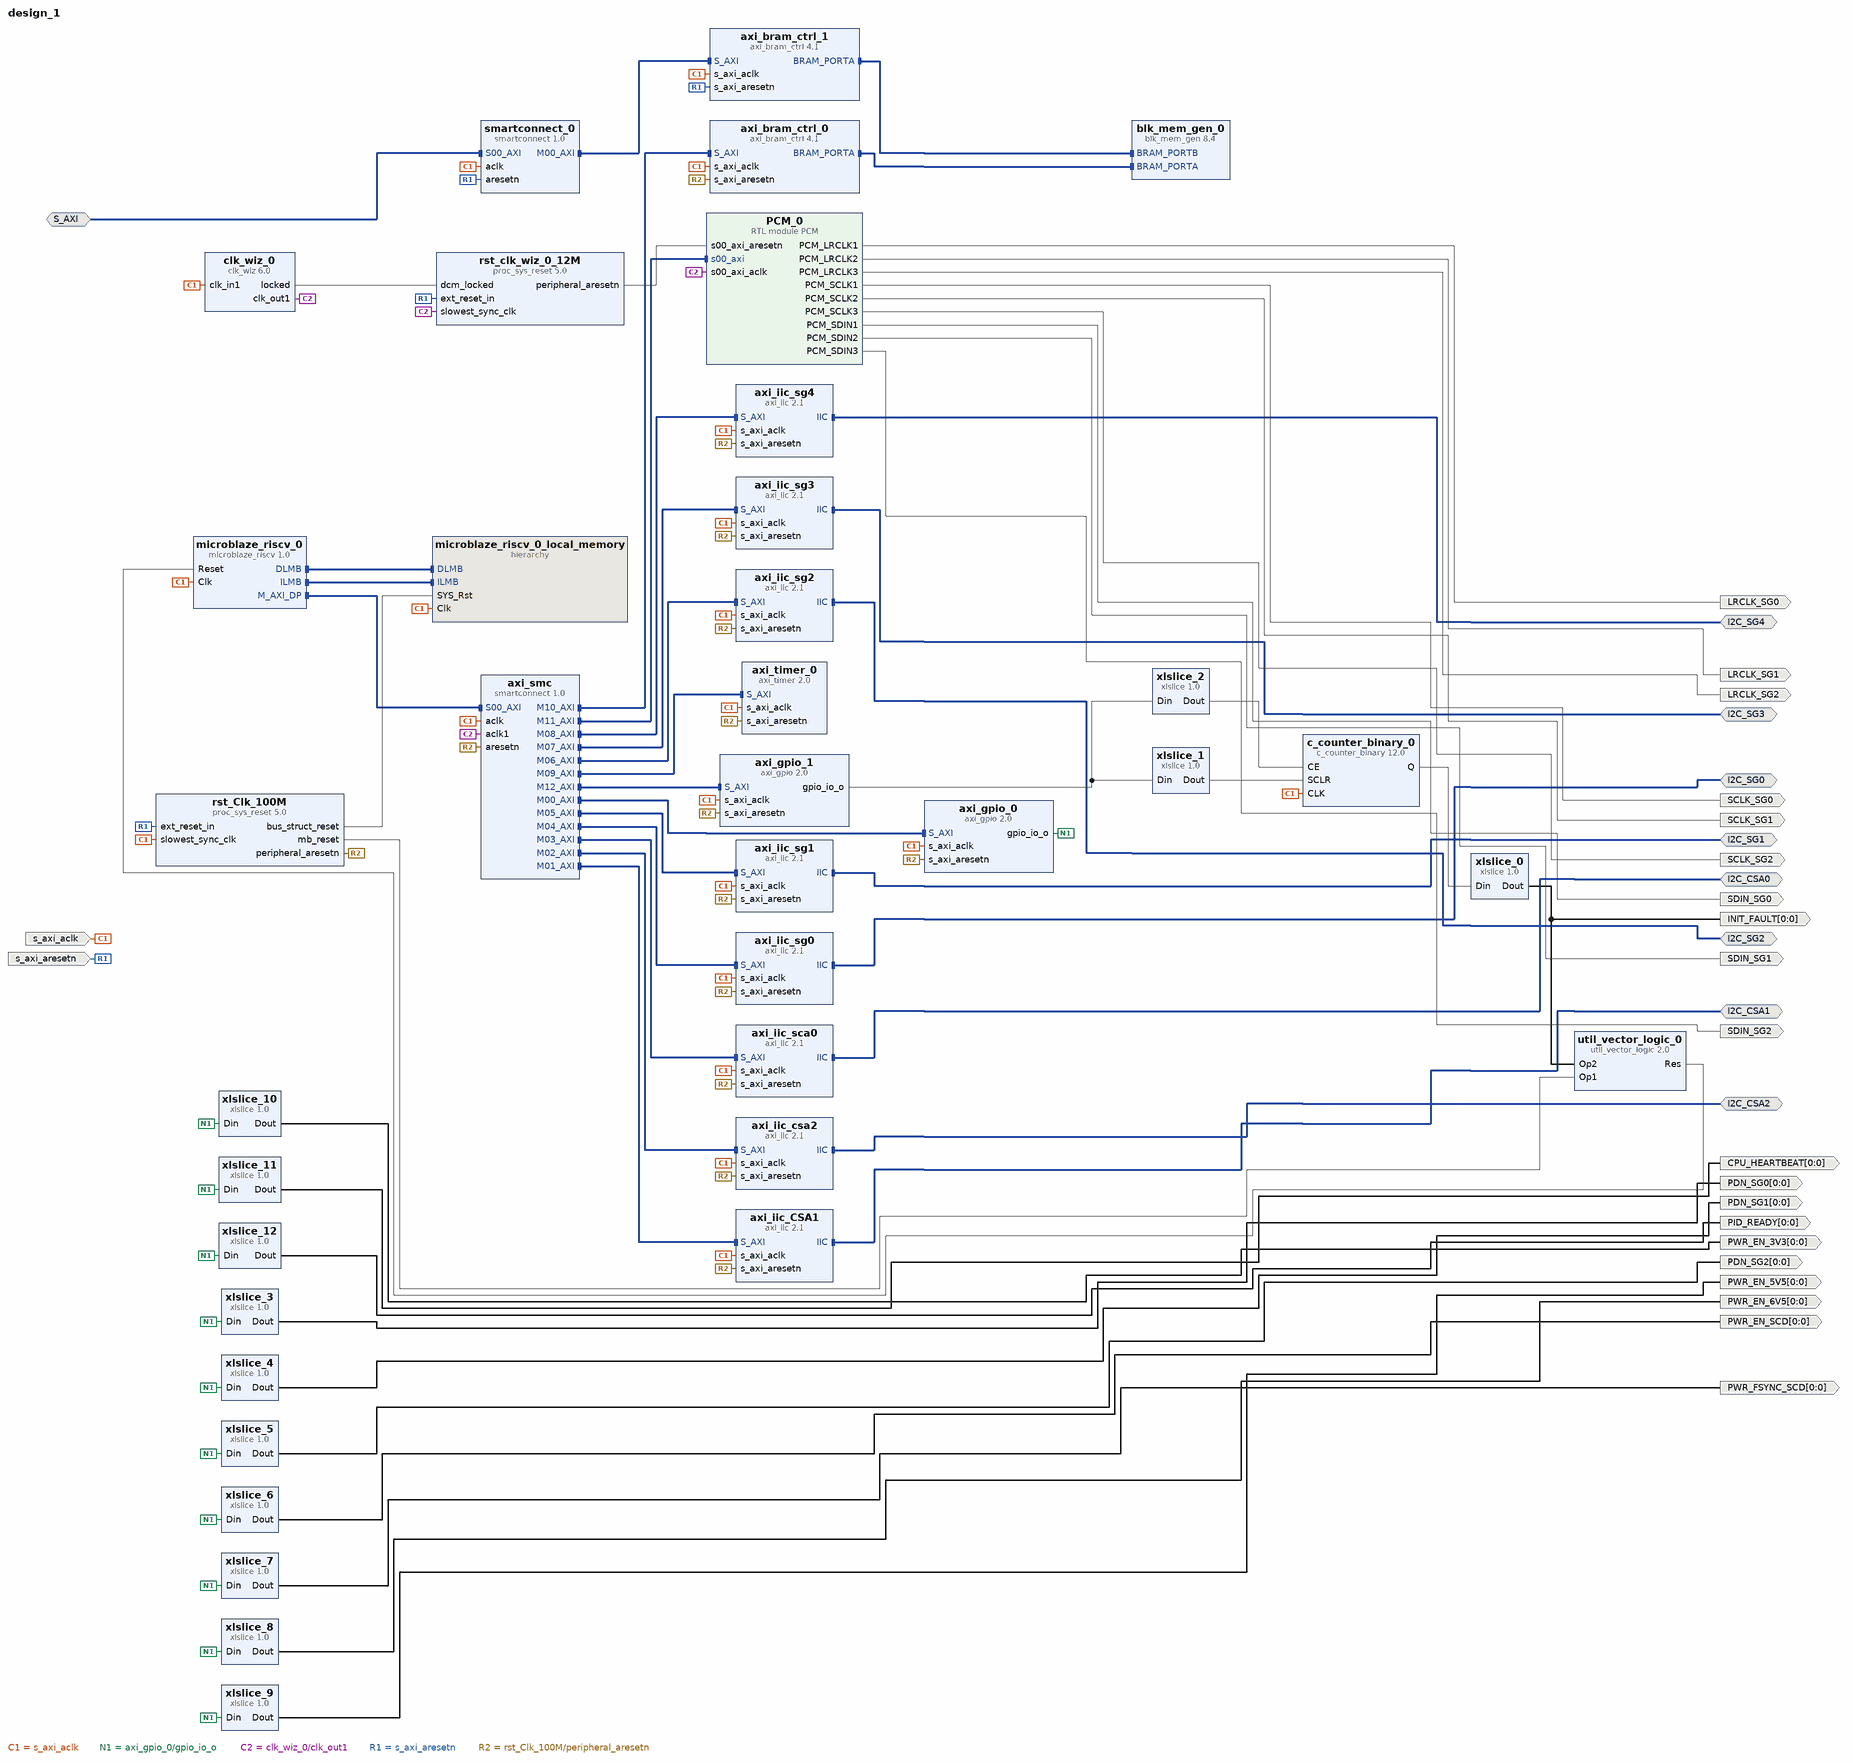
[diagram p0: block diagram of the top level]
# Vivado block design design_1, xc7s100fgga484-1, Vivado 2024.2
create_bd_design design_1

create_bd_intf_port -mode Master -vlnv xilinx.com:interface:iic_rtl:1.0 I2C_SG0
create_bd_intf_port -mode Master -vlnv xilinx.com:interface:iic_rtl:1.0 I2C_SG1
create_bd_intf_port -mode Master -vlnv xilinx.com:interface:iic_rtl:1.0 I2C_SG2
create_bd_intf_port -mode Master -vlnv xilinx.com:interface:iic_rtl:1.0 I2C_SG3
create_bd_intf_port -mode Master -vlnv xilinx.com:interface:iic_rtl:1.0 I2C_SG4
create_bd_intf_port -mode Master -vlnv xilinx.com:interface:iic_rtl:1.0 I2C_CSA0
create_bd_intf_port -mode Master -vlnv xilinx.com:interface:iic_rtl:1.0 I2C_CSA1
create_bd_intf_port -mode Master -vlnv xilinx.com:interface:iic_rtl:1.0 I2C_CSA2
create_bd_intf_port -mode Slave -vlnv xilinx.com:interface:aximm_rtl:1.0 S_AXI
set_property -dict [list \
  CONFIG.ADDR_WIDTH 32 \
  CONFIG.ARUSER_WIDTH 0 \
  CONFIG.AWUSER_WIDTH 0 \
  CONFIG.BUSER_WIDTH 0 \
  CONFIG.DATA_WIDTH 32 \
  CONFIG.HAS_BRESP 1 \
  CONFIG.HAS_BURST 1 \
  CONFIG.HAS_CACHE 1 \
  CONFIG.HAS_LOCK 1 \
  CONFIG.HAS_PROT 1 \
  CONFIG.HAS_QOS 1 \
  CONFIG.HAS_REGION 1 \
  CONFIG.HAS_RRESP 1 \
  CONFIG.HAS_WSTRB 1 \
  CONFIG.ID_WIDTH 0 \
  CONFIG.MAX_BURST_LENGTH 256 \
  CONFIG.NUM_READ_OUTSTANDING 1 \
  CONFIG.NUM_READ_THREADS 1 \
  CONFIG.NUM_WRITE_OUTSTANDING 1 \
  CONFIG.NUM_WRITE_THREADS 1 \
  CONFIG.PROTOCOL AXI4 \
  CONFIG.READ_WRITE_MODE READ_WRITE \
  CONFIG.RUSER_BITS_PER_BYTE 0 \
  CONFIG.RUSER_WIDTH 0 \
  CONFIG.SUPPORTS_NARROW_BURST 1 \
  CONFIG.WUSER_BITS_PER_BYTE 0 \
  CONFIG.WUSER_WIDTH 0 \
] [get_bd_intf_ports S_AXI]
create_bd_port -dir I -type rst s_axi_aresetn
set_property -dict {CONFIG.POLARITY ACTIVE_LOW} [get_bd_ports s_axi_aresetn]
create_bd_port -dir O LRCLK_SG0
create_bd_port -dir O SCLK_SG0
create_bd_port -dir O SDIN_SG0
create_bd_port -dir O LRCLK_SG1
create_bd_port -dir O SCLK_SG1
create_bd_port -dir O SDIN_SG1
create_bd_port -dir O LRCLK_SG2
create_bd_port -dir O SCLK_SG2
create_bd_port -dir O SDIN_SG2
create_bd_port -dir O -from 0 -to 0 INIT_FAULT
create_bd_port -dir I -type clk s_axi_aclk
set_property -dict {CONFIG.ASSOCIATED_BUSIF S_AXI} [get_bd_ports s_axi_aclk]
create_bd_port -dir O -from 0 -to 0 PDN_SG0
create_bd_port -dir O -from 0 -to 0 PDN_SG1
create_bd_port -dir O -from 0 -to 0 PDN_SG2
create_bd_port -dir O -from 0 -to 0 PWR_EN_SCD
create_bd_port -dir O -from 0 -to 0 PWR_FSYNC_SCD
create_bd_port -dir O -from 0 -to 0 PWR_EN_6V5
create_bd_port -dir O -from 0 -to 0 PWR_EN_5V5
create_bd_port -dir O -from 0 -to 0 PWR_EN_3V3
create_bd_port -dir O -from 0 -to 0 CPU_HEARTBEAT
create_bd_port -dir O -from 0 -to 0 PID_READY

create_bd_cell -type ip -vlnv xilinx.com:ip:microblaze_riscv:1.0 microblaze_riscv_0
set_property -dict {CONFIG.C_DEBUG_ENABLED 1 CONFIG.C_D_AXI 1 CONFIG.C_D_LMB 1 CONFIG.C_I_LMB 1} [get_bd_cells microblaze_riscv_0]
create_bd_cell -type hier microblaze_riscv_0_local_memory
create_bd_cell -type ip -vlnv xilinx.com:ip:proc_sys_reset:5.0 rst_Clk_100M
create_bd_cell -type ip -vlnv xilinx.com:ip:clk_wiz:6.0 clk_wiz_0
set_property -dict [list \
  CONFIG.CLKOUT1_JITTER 360.948 \
  CONFIG.CLKOUT1_PHASE_ERROR 301.601 \
  CONFIG.CLKOUT1_REQUESTED_OUT_FREQ 12.288 \
  CONFIG.MMCM_CLKFBOUT_MULT_F 48.000 \
  CONFIG.MMCM_CLKOUT0_DIVIDE_F 78.125 \
  CONFIG.MMCM_DIVCLK_DIVIDE 5 \
  CONFIG.USE_LOCKED true \
  CONFIG.USE_RESET false \
] [get_bd_cells clk_wiz_0]
create_bd_cell -type ip -vlnv xilinx.com:ip:proc_sys_reset:5.0 rst_clk_wiz_0_12M
create_bd_cell -type ip -vlnv xilinx.com:ip:axi_timer:2.0 axi_timer_0
set_property -dict {CONFIG.enable_timer2 0} [get_bd_cells axi_timer_0]
create_bd_cell -type ip -vlnv xilinx.com:ip:axi_iic:2.1 axi_iic_sg0
set_property -dict {CONFIG.IIC_FREQ_KHZ 100} [get_bd_cells axi_iic_sg0]
create_bd_cell -type ip -vlnv xilinx.com:ip:axi_iic:2.1 axi_iic_sg1
set_property -dict {CONFIG.IIC_FREQ_KHZ 100} [get_bd_cells axi_iic_sg1]
create_bd_cell -type ip -vlnv xilinx.com:ip:axi_iic:2.1 axi_iic_sg2
set_property -dict {CONFIG.IIC_FREQ_KHZ 100} [get_bd_cells axi_iic_sg2]
create_bd_cell -type ip -vlnv xilinx.com:ip:axi_iic:2.1 axi_iic_sg3
set_property -dict {CONFIG.C_DEFAULT_VALUE 0x00 CONFIG.IIC_FREQ_KHZ 100} [get_bd_cells axi_iic_sg3]
create_bd_cell -type ip -vlnv xilinx.com:ip:axi_iic:2.1 axi_iic_sg4
set_property -dict {CONFIG.IIC_FREQ_KHZ 100} [get_bd_cells axi_iic_sg4]
create_bd_cell -type ip -vlnv xilinx.com:ip:axi_iic:2.1 axi_iic_sca0
set_property -dict {CONFIG.IIC_FREQ_KHZ 1000} [get_bd_cells axi_iic_sca0]
create_bd_cell -type ip -vlnv xilinx.com:ip:axi_iic:2.1 axi_iic_CSA1
set_property -dict {CONFIG.IIC_FREQ_KHZ 1000} [get_bd_cells axi_iic_CSA1]
create_bd_cell -type ip -vlnv xilinx.com:ip:axi_iic:2.1 axi_iic_csa2
set_property -dict {CONFIG.IIC_FREQ_KHZ 1000} [get_bd_cells axi_iic_csa2]
create_bd_cell -type ip -vlnv xilinx.com:ip:c_counter_binary:12.0 c_counter_binary_0
set_property -dict {CONFIG.CE true CONFIG.Output_Width 24 CONFIG.SCLR true} [get_bd_cells c_counter_binary_0]
create_bd_cell -type ip -vlnv xilinx.com:ip:axi_gpio:2.0 axi_gpio_0
set_property -dict {CONFIG.C_ALL_OUTPUTS 1 CONFIG.C_GPIO_WIDTH 10} [get_bd_cells axi_gpio_0]
create_bd_cell -type module -reference PCM PCM_0
create_bd_cell -type ip -vlnv xilinx.com:ip:smartconnect:1.0 axi_smc
set_property -dict {CONFIG.NUM_CLKS 2 CONFIG.NUM_MI 13 CONFIG.NUM_SI 1} [get_bd_cells axi_smc]
create_bd_cell -type ip -vlnv xilinx.com:ip:axi_gpio:2.0 axi_gpio_1
set_property -dict {CONFIG.C_ALL_OUTPUTS 1 CONFIG.C_GPIO_WIDTH 2} [get_bd_cells axi_gpio_1]
create_bd_cell -type ip -vlnv xilinx.com:ip:xlslice:1.0 xlslice_1
set_property -dict {CONFIG.DIN_WIDTH 2} [get_bd_cells xlslice_1]
create_bd_cell -type ip -vlnv xilinx.com:ip:xlslice:1.0 xlslice_2
set_property -dict {CONFIG.DIN_FROM 1 CONFIG.DIN_TO 1 CONFIG.DIN_WIDTH 2} [get_bd_cells xlslice_2]
create_bd_cell -type ip -vlnv xilinx.com:ip:xlslice:1.0 xlslice_0
set_property -dict {CONFIG.DIN_FROM 23 CONFIG.DIN_TO 23 CONFIG.DIN_WIDTH 24} [get_bd_cells xlslice_0]
create_bd_cell -type ip -vlnv xilinx.com:ip:util_vector_logic:2.0 util_vector_logic_0
set_property -dict {CONFIG.C_OPERATION or CONFIG.C_SIZE 1} [get_bd_cells util_vector_logic_0]
create_bd_cell -type ip -vlnv xilinx.com:ip:xlslice:1.0 xlslice_3
set_property -dict {CONFIG.DIN_WIDTH 10} [get_bd_cells xlslice_3]
create_bd_cell -type ip -vlnv xilinx.com:ip:xlslice:1.0 xlslice_4
set_property -dict {CONFIG.DIN_FROM 1 CONFIG.DIN_TO 1 CONFIG.DIN_WIDTH 10} [get_bd_cells xlslice_4]
create_bd_cell -type ip -vlnv xilinx.com:ip:xlslice:1.0 xlslice_5
set_property -dict {CONFIG.DIN_FROM 2 CONFIG.DIN_TO 2 CONFIG.DIN_WIDTH 10} [get_bd_cells xlslice_5]
create_bd_cell -type ip -vlnv xilinx.com:ip:xlslice:1.0 xlslice_6
set_property -dict {CONFIG.DIN_FROM 3 CONFIG.DIN_TO 3 CONFIG.DIN_WIDTH 10} [get_bd_cells xlslice_6]
create_bd_cell -type ip -vlnv xilinx.com:ip:xlslice:1.0 xlslice_7
set_property -dict {CONFIG.DIN_FROM 4 CONFIG.DIN_TO 4 CONFIG.DIN_WIDTH 10} [get_bd_cells xlslice_7]
create_bd_cell -type ip -vlnv xilinx.com:ip:xlslice:1.0 xlslice_8
set_property -dict {CONFIG.DIN_FROM 5 CONFIG.DIN_TO 5 CONFIG.DIN_WIDTH 10} [get_bd_cells xlslice_8]
create_bd_cell -type ip -vlnv xilinx.com:ip:xlslice:1.0 xlslice_9
set_property -dict {CONFIG.DIN_FROM 6 CONFIG.DIN_TO 6 CONFIG.DIN_WIDTH 10} [get_bd_cells xlslice_9]
create_bd_cell -type ip -vlnv xilinx.com:ip:xlslice:1.0 xlslice_10
set_property -dict {CONFIG.DIN_FROM 7 CONFIG.DIN_TO 7 CONFIG.DIN_WIDTH 10} [get_bd_cells xlslice_10]
create_bd_cell -type ip -vlnv xilinx.com:ip:xlslice:1.0 xlslice_11
set_property -dict {CONFIG.DIN_FROM 8 CONFIG.DIN_TO 8 CONFIG.DIN_WIDTH 10} [get_bd_cells xlslice_11]
create_bd_cell -type ip -vlnv xilinx.com:ip:xlslice:1.0 xlslice_12
set_property -dict {CONFIG.DIN_FROM 9 CONFIG.DIN_TO 9 CONFIG.DIN_WIDTH 10} [get_bd_cells xlslice_12]
create_bd_cell -type ip -vlnv xilinx.com:ip:axi_bram_ctrl:4.1 axi_bram_ctrl_0
set_property -dict {CONFIG.SINGLE_PORT_BRAM 1} [get_bd_cells axi_bram_ctrl_0]
create_bd_cell -type ip -vlnv xilinx.com:ip:blk_mem_gen:8.4 blk_mem_gen_0
set_property -dict {CONFIG.Memory_Type True_Dual_Port_RAM} [get_bd_cells blk_mem_gen_0]
create_bd_cell -type ip -vlnv xilinx.com:ip:axi_bram_ctrl:4.1 axi_bram_ctrl_1
set_property -dict {CONFIG.SINGLE_PORT_BRAM 1} [get_bd_cells axi_bram_ctrl_1]
create_bd_cell -type ip -vlnv xilinx.com:ip:smartconnect:1.0 smartconnect_0
set_property -dict {CONFIG.NUM_SI 1} [get_bd_cells smartconnect_0]

# ---- hierarchy /microblaze_riscv_0_local_memory ----
current_bd_instance /microblaze_riscv_0_local_memory
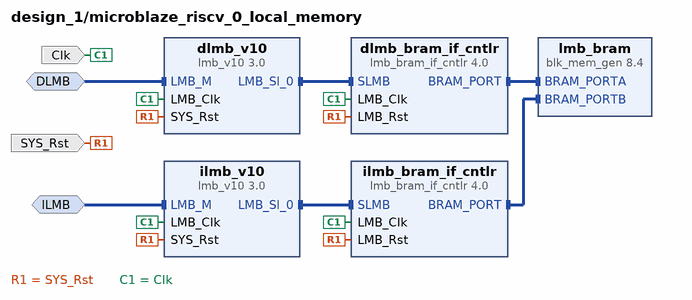
[diagram p1: block diagram inside /microblaze_riscv_0_local_memory]
create_bd_intf_pin -mode MirroredMaster -vlnv xilinx.com:interface:lmb_rtl:1.0 DLMB
create_bd_intf_pin -mode MirroredMaster -vlnv xilinx.com:interface:lmb_rtl:1.0 ILMB
create_bd_pin -dir I -type clk Clk
create_bd_pin -dir I -type rst SYS_Rst

create_bd_cell -type ip -vlnv xilinx.com:ip:lmb_v10:3.0 dlmb_v10
create_bd_cell -type ip -vlnv xilinx.com:ip:lmb_v10:3.0 ilmb_v10
create_bd_cell -type ip -vlnv xilinx.com:ip:lmb_bram_if_cntlr:4.0 dlmb_bram_if_cntlr
set_property -dict {CONFIG.C_ECC 0} [get_bd_cells dlmb_bram_if_cntlr]
create_bd_cell -type ip -vlnv xilinx.com:ip:lmb_bram_if_cntlr:4.0 ilmb_bram_if_cntlr
set_property -dict {CONFIG.C_ECC 0} [get_bd_cells ilmb_bram_if_cntlr]
create_bd_cell -type ip -vlnv xilinx.com:ip:blk_mem_gen:8.4 lmb_bram
set_property -dict {CONFIG.Memory_Type True_Dual_Port_RAM CONFIG.use_bram_block BRAM_Controller} [get_bd_cells lmb_bram]

# ---- connections ----

current_bd_instance /microblaze_riscv_0_local_memory
connect_bd_intf_net -intf_net microblaze_riscv_0_dlmb [get_bd_intf_pins dlmb_v10/LMB_M] [get_bd_intf_pins DLMB]
connect_bd_intf_net -intf_net microblaze_riscv_0_dlmb_bus [get_bd_intf_pins dlmb_v10/LMB_Sl_0] [get_bd_intf_pins dlmb_bram_if_cntlr/SLMB]
connect_bd_intf_net -intf_net microblaze_riscv_0_dlmb_cntlr [get_bd_intf_pins dlmb_bram_if_cntlr/BRAM_PORT] [get_bd_intf_pins lmb_bram/BRAM_PORTA]
connect_bd_intf_net -intf_net microblaze_riscv_0_ilmb [get_bd_intf_pins ilmb_v10/LMB_M] [get_bd_intf_pins ILMB]
connect_bd_intf_net -intf_net microblaze_riscv_0_ilmb_bus [get_bd_intf_pins ilmb_v10/LMB_Sl_0] [get_bd_intf_pins ilmb_bram_if_cntlr/SLMB]
connect_bd_intf_net -intf_net microblaze_riscv_0_ilmb_cntlr [get_bd_intf_pins ilmb_bram_if_cntlr/BRAM_PORT] [get_bd_intf_pins lmb_bram/BRAM_PORTB]
connect_bd_net [get_bd_pins SYS_Rst] \
  [get_bd_pins dlmb_v10/SYS_Rst] [get_bd_pins dlmb_bram_if_cntlr/LMB_Rst] [get_bd_pins ilmb_v10/SYS_Rst] \
  [get_bd_pins ilmb_bram_if_cntlr/LMB_Rst]
connect_bd_net -net microblaze_riscv_0_Clk [get_bd_pins Clk] \
  [get_bd_pins dlmb_v10/LMB_Clk] [get_bd_pins dlmb_bram_if_cntlr/LMB_Clk] [get_bd_pins ilmb_v10/LMB_Clk] \
  [get_bd_pins ilmb_bram_if_cntlr/LMB_Clk]
set_property HDL_ATTRIBUTE.BMM_INFO_ADDRESS_SPACE {byte  0x00000000 32 > design_1 microblaze_riscv_0_local_memory/lmb_bram} [get_bd_cells dlmb_bram_if_cntlr]
set_property HDL_ATTRIBUTE.KEEP_HIERARCHY yes [get_bd_cells dlmb_bram_if_cntlr]

current_bd_instance /
connect_bd_intf_net -intf_net S00_AXI_0_1 [get_bd_intf_ports S_AXI] [get_bd_intf_pins smartconnect_0/S00_AXI]
connect_bd_intf_net [get_bd_intf_pins blk_mem_gen_0/BRAM_PORTA] [get_bd_intf_pins axi_bram_ctrl_0/BRAM_PORTA]
connect_bd_intf_net [get_bd_intf_pins axi_bram_ctrl_1/BRAM_PORTA] [get_bd_intf_pins blk_mem_gen_0/BRAM_PORTB]
connect_bd_intf_net -intf_net axi_iic_0_IIC [get_bd_intf_ports I2C_SG0] [get_bd_intf_pins axi_iic_sg0/IIC]
connect_bd_intf_net -intf_net axi_iic_1_IIC [get_bd_intf_ports I2C_SG1] [get_bd_intf_pins axi_iic_sg1/IIC]
connect_bd_intf_net -intf_net axi_iic_2_IIC [get_bd_intf_ports I2C_SG2] [get_bd_intf_pins axi_iic_sg2/IIC]
connect_bd_intf_net -intf_net axi_iic_3_IIC [get_bd_intf_ports I2C_SG3] [get_bd_intf_pins axi_iic_sg3/IIC]
connect_bd_intf_net -intf_net axi_iic_4_IIC [get_bd_intf_ports I2C_SG4] [get_bd_intf_pins axi_iic_sg4/IIC]
connect_bd_intf_net -intf_net axi_iic_5_IIC [get_bd_intf_ports I2C_CSA0] [get_bd_intf_pins axi_iic_sca0/IIC]
connect_bd_intf_net -intf_net axi_iic_6_IIC [get_bd_intf_ports I2C_CSA1] [get_bd_intf_pins axi_iic_CSA1/IIC]
connect_bd_intf_net -intf_net axi_iic_7_IIC [get_bd_intf_ports I2C_CSA2] [get_bd_intf_pins axi_iic_csa2/IIC]
connect_bd_intf_net [get_bd_intf_pins axi_smc/M00_AXI] [get_bd_intf_pins axi_gpio_0/S_AXI]
connect_bd_intf_net [get_bd_intf_pins axi_smc/M01_AXI] [get_bd_intf_pins axi_iic_CSA1/S_AXI]
connect_bd_intf_net [get_bd_intf_pins axi_smc/M02_AXI] [get_bd_intf_pins axi_iic_csa2/S_AXI]
connect_bd_intf_net [get_bd_intf_pins axi_smc/M03_AXI] [get_bd_intf_pins axi_iic_sca0/S_AXI]
connect_bd_intf_net [get_bd_intf_pins axi_smc/M04_AXI] [get_bd_intf_pins axi_iic_sg0/S_AXI]
connect_bd_intf_net [get_bd_intf_pins axi_smc/M05_AXI] [get_bd_intf_pins axi_iic_sg1/S_AXI]
connect_bd_intf_net [get_bd_intf_pins axi_smc/M06_AXI] [get_bd_intf_pins axi_iic_sg2/S_AXI]
connect_bd_intf_net [get_bd_intf_pins axi_smc/M07_AXI] [get_bd_intf_pins axi_iic_sg3/S_AXI]
connect_bd_intf_net [get_bd_intf_pins axi_smc/M08_AXI] [get_bd_intf_pins axi_iic_sg4/S_AXI]
connect_bd_intf_net [get_bd_intf_pins axi_smc/M09_AXI] [get_bd_intf_pins axi_timer_0/S_AXI]
connect_bd_intf_net [get_bd_intf_pins axi_bram_ctrl_0/S_AXI] [get_bd_intf_pins axi_smc/M10_AXI]
connect_bd_intf_net [get_bd_intf_pins axi_smc/M11_AXI] [get_bd_intf_pins PCM_0/s00_axi]
connect_bd_intf_net [get_bd_intf_pins axi_smc/M12_AXI] [get_bd_intf_pins axi_gpio_1/S_AXI]
connect_bd_intf_net [get_bd_intf_pins microblaze_riscv_0/M_AXI_DP] [get_bd_intf_pins axi_smc/S00_AXI]
connect_bd_intf_net [get_bd_intf_pins microblaze_riscv_0/DLMB] [get_bd_intf_pins microblaze_riscv_0_local_memory/DLMB]
connect_bd_intf_net [get_bd_intf_pins microblaze_riscv_0/ILMB] [get_bd_intf_pins microblaze_riscv_0_local_memory/ILMB]
connect_bd_intf_net [get_bd_intf_pins smartconnect_0/M00_AXI] [get_bd_intf_pins axi_bram_ctrl_1/S_AXI]
connect_bd_net -net Clk_0_1 [get_bd_ports s_axi_aclk] \
  [get_bd_pins microblaze_riscv_0/Clk] [get_bd_pins microblaze_riscv_0_local_memory/Clk] \
  [get_bd_pins rst_Clk_100M/slowest_sync_clk] [get_bd_pins clk_wiz_0/clk_in1] [get_bd_pins axi_timer_0/s_axi_aclk] \
  [get_bd_pins axi_iic_sg0/s_axi_aclk] [get_bd_pins axi_iic_sg1/s_axi_aclk] [get_bd_pins axi_iic_sg2/s_axi_aclk] \
  [get_bd_pins axi_iic_sg3/s_axi_aclk] [get_bd_pins axi_iic_sg4/s_axi_aclk] [get_bd_pins axi_iic_sca0/s_axi_aclk] \
  [get_bd_pins axi_iic_CSA1/s_axi_aclk] [get_bd_pins axi_iic_csa2/s_axi_aclk] [get_bd_pins c_counter_binary_0/CLK] \
  [get_bd_pins axi_gpio_0/s_axi_aclk] [get_bd_pins axi_smc/aclk] [get_bd_pins axi_gpio_1/s_axi_aclk] \
  [get_bd_pins axi_bram_ctrl_0/s_axi_aclk] [get_bd_pins axi_bram_ctrl_1/s_axi_aclk] [get_bd_pins smartconnect_0/aclk]
connect_bd_net [get_bd_pins PCM_0/PCM_LRCLK1] [get_bd_ports LRCLK_SG0]
connect_bd_net [get_bd_pins PCM_0/PCM_LRCLK2] [get_bd_ports LRCLK_SG1]
connect_bd_net [get_bd_pins PCM_0/PCM_LRCLK3] [get_bd_ports LRCLK_SG2]
connect_bd_net [get_bd_pins PCM_0/PCM_SCLK1] [get_bd_ports SCLK_SG0]
connect_bd_net [get_bd_pins PCM_0/PCM_SCLK2] [get_bd_ports SCLK_SG1]
connect_bd_net [get_bd_pins PCM_0/PCM_SCLK3] [get_bd_ports SCLK_SG2]
connect_bd_net [get_bd_pins PCM_0/PCM_SDIN1] [get_bd_ports SDIN_SG0]
connect_bd_net [get_bd_pins PCM_0/PCM_SDIN2] [get_bd_ports SDIN_SG1]
connect_bd_net [get_bd_pins PCM_0/PCM_SDIN3] [get_bd_ports SDIN_SG2]
connect_bd_net [get_bd_pins axi_gpio_0/gpio_io_o] \
  [get_bd_pins xlslice_3/Din] [get_bd_pins xlslice_4/Din] [get_bd_pins xlslice_5/Din] [get_bd_pins xlslice_6/Din] \
  [get_bd_pins xlslice_7/Din] [get_bd_pins xlslice_8/Din] [get_bd_pins xlslice_9/Din] [get_bd_pins xlslice_10/Din] \
  [get_bd_pins xlslice_11/Din] [get_bd_pins xlslice_12/Din]
connect_bd_net [get_bd_pins axi_gpio_1/gpio_io_o] [get_bd_pins xlslice_1/Din] [get_bd_pins xlslice_2/Din]
connect_bd_net [get_bd_pins c_counter_binary_0/Q] [get_bd_pins xlslice_0/Din]
connect_bd_net [get_bd_pins clk_wiz_0/clk_out1] \
  [get_bd_pins rst_clk_wiz_0_12M/slowest_sync_clk] [get_bd_pins PCM_0/s00_axi_aclk] [get_bd_pins axi_smc/aclk1]
connect_bd_net [get_bd_pins clk_wiz_0/locked] [get_bd_pins rst_clk_wiz_0_12M/dcm_locked]
connect_bd_net -net reset_rtl_0_1 [get_bd_ports s_axi_aresetn] \
  [get_bd_pins rst_Clk_100M/ext_reset_in] [get_bd_pins rst_clk_wiz_0_12M/ext_reset_in] \
  [get_bd_pins axi_bram_ctrl_1/s_axi_aresetn] [get_bd_pins smartconnect_0/aresetn]
connect_bd_net [get_bd_pins rst_Clk_100M/bus_struct_reset] [get_bd_pins microblaze_riscv_0_local_memory/SYS_Rst]
connect_bd_net [get_bd_pins rst_Clk_100M/mb_reset] [get_bd_pins util_vector_logic_0/Op1]
connect_bd_net [get_bd_pins rst_Clk_100M/peripheral_aresetn] \
  [get_bd_pins axi_timer_0/s_axi_aresetn] [get_bd_pins axi_iic_sg0/s_axi_aresetn] [get_bd_pins axi_iic_sg1/s_axi_aresetn] \
  [get_bd_pins axi_iic_sg2/s_axi_aresetn] [get_bd_pins axi_iic_sg3/s_axi_aresetn] [get_bd_pins axi_iic_sg4/s_axi_aresetn] \
  [get_bd_pins axi_iic_sca0/s_axi_aresetn] [get_bd_pins axi_iic_CSA1/s_axi_aresetn] [get_bd_pins axi_iic_csa2/s_axi_aresetn] \
  [get_bd_pins axi_gpio_0/s_axi_aresetn] [get_bd_pins axi_smc/aresetn] [get_bd_pins axi_gpio_1/s_axi_aresetn] \
  [get_bd_pins axi_bram_ctrl_0/s_axi_aresetn]
connect_bd_net [get_bd_pins rst_clk_wiz_0_12M/peripheral_aresetn] [get_bd_pins PCM_0/s00_axi_aresetn]
connect_bd_net [get_bd_pins util_vector_logic_0/Res] [get_bd_pins microblaze_riscv_0/Reset]
connect_bd_net [get_bd_pins xlslice_0/Dout] [get_bd_ports INIT_FAULT] [get_bd_pins util_vector_logic_0/Op2]
connect_bd_net [get_bd_pins xlslice_10/Dout] [get_bd_ports PWR_EN_3V3]
connect_bd_net [get_bd_pins xlslice_11/Dout] [get_bd_ports CPU_HEARTBEAT]
connect_bd_net [get_bd_pins xlslice_12/Dout] [get_bd_ports PID_READY]
connect_bd_net [get_bd_pins xlslice_1/Dout] [get_bd_pins c_counter_binary_0/SCLR]
connect_bd_net [get_bd_pins xlslice_2/Dout] [get_bd_pins c_counter_binary_0/CE]
connect_bd_net [get_bd_pins xlslice_3/Dout] [get_bd_ports PDN_SG0]
connect_bd_net [get_bd_pins xlslice_4/Dout] [get_bd_ports PDN_SG1]
connect_bd_net [get_bd_pins xlslice_5/Dout] [get_bd_ports PDN_SG2]
connect_bd_net [get_bd_pins xlslice_6/Dout] [get_bd_ports PWR_EN_SCD]
connect_bd_net [get_bd_pins xlslice_7/Dout] [get_bd_ports PWR_FSYNC_SCD]
connect_bd_net [get_bd_pins xlslice_8/Dout] [get_bd_ports PWR_EN_6V5]
connect_bd_net [get_bd_pins xlslice_9/Dout] [get_bd_ports PWR_EN_5V5]
set_property HDL_ATTRIBUTE.BMM_INFO_PROCESSOR {riscv > design_1 microblaze_riscv_0_local_memory/dlmb_bram_if_cntlr design_1 axi_bram_ctrl_0} [get_bd_cells microblaze_riscv_0]
set_property HDL_ATTRIBUTE.KEEP_HIERARCHY yes [get_bd_cells microblaze_riscv_0]
set_property HDL_ATTRIBUTE.BMM_INFO_ADDRESS_SPACE {byte  0x00010000 32 > design_1 blk_mem_gen_0} [get_bd_cells axi_bram_ctrl_0]
set_property HDL_ATTRIBUTE.KEEP_HIERARCHY yes [get_bd_cells axi_bram_ctrl_0]

# ---- address map ----
assign_bd_address -offset 0x00000000 -range 64K -target_address_space [get_bd_addr_spaces microblaze_riscv_0/Data] [get_bd_addr_segs microblaze_riscv_0_local_memory/dlmb_bram_if_cntlr/SLMB/Mem]
assign_bd_address -offset 0x00010000 -range 4K -target_address_space [get_bd_addr_spaces microblaze_riscv_0/Data] [get_bd_addr_segs axi_bram_ctrl_0/S_AXI/Mem0]
assign_bd_address -offset 0x00020000 -range 4K -target_address_space [get_bd_addr_spaces microblaze_riscv_0/Data] [get_bd_addr_segs PCM_0/s00_axi/reg0]
assign_bd_address -offset 0x40000000 -range 64K -target_address_space [get_bd_addr_spaces microblaze_riscv_0/Data] [get_bd_addr_segs axi_gpio_0/S_AXI/Reg]
assign_bd_address -offset 0x40010000 -range 64K -target_address_space [get_bd_addr_spaces microblaze_riscv_0/Data] [get_bd_addr_segs axi_gpio_1/S_AXI/Reg]
assign_bd_address -offset 0x40800000 -range 64K -target_address_space [get_bd_addr_spaces microblaze_riscv_0/Data] [get_bd_addr_segs axi_iic_CSA1/S_AXI/Reg]
assign_bd_address -offset 0x40810000 -range 64K -target_address_space [get_bd_addr_spaces microblaze_riscv_0/Data] [get_bd_addr_segs axi_iic_csa2/S_AXI/Reg]
assign_bd_address -offset 0x40820000 -range 64K -target_address_space [get_bd_addr_spaces microblaze_riscv_0/Data] [get_bd_addr_segs axi_iic_sca0/S_AXI/Reg]
assign_bd_address -offset 0x40830000 -range 64K -target_address_space [get_bd_addr_spaces microblaze_riscv_0/Data] [get_bd_addr_segs axi_iic_sg0/S_AXI/Reg]
assign_bd_address -offset 0x40840000 -range 64K -target_address_space [get_bd_addr_spaces microblaze_riscv_0/Data] [get_bd_addr_segs axi_iic_sg1/S_AXI/Reg]
assign_bd_address -offset 0x40850000 -range 64K -target_address_space [get_bd_addr_spaces microblaze_riscv_0/Data] [get_bd_addr_segs axi_iic_sg2/S_AXI/Reg]
assign_bd_address -offset 0x40860000 -range 64K -target_address_space [get_bd_addr_spaces microblaze_riscv_0/Data] [get_bd_addr_segs axi_iic_sg3/S_AXI/Reg]
assign_bd_address -offset 0x40870000 -range 64K -target_address_space [get_bd_addr_spaces microblaze_riscv_0/Data] [get_bd_addr_segs axi_iic_sg4/S_AXI/Reg]
assign_bd_address -offset 0x41C00000 -range 64K -target_address_space [get_bd_addr_spaces microblaze_riscv_0/Data] [get_bd_addr_segs axi_timer_0/S_AXI/Reg]
assign_bd_address -offset 0x00000000 -range 64K -target_address_space [get_bd_addr_spaces microblaze_riscv_0/Instruction] [get_bd_addr_segs microblaze_riscv_0_local_memory/ilmb_bram_if_cntlr/SLMB/Mem]
assign_bd_address -offset 0x00010000 -range 4K -target_address_space [get_bd_addr_spaces S_AXI] [get_bd_addr_segs axi_bram_ctrl_1/S_AXI/Mem0]

validate_bd_design
save_bd_design
